# Altium schematic sheet Dcdc.12V0.+3V3.SchDoc
size A4
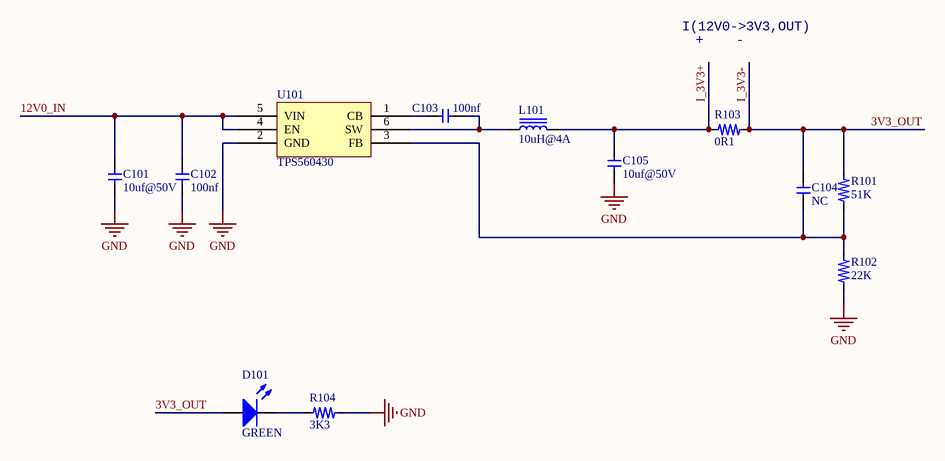
[diagram p0: Dcdc.12V0.+3V3.SchDoc]

## Parts
C101  value 10uf@50V  [C1210]  (hidden comment: Cap)
C102  value 100nf  [C0603]  (hidden comment: Cap)
C103  value 100nf  [C0603]  (hidden comment: Cap)
C104  value NC  [C0603]  (hidden comment: Cap)
C105  value 10uf@50V  [C1210]  (hidden comment: Cap)
D101  value GREEN  [LED0603]  (hidden comment: LED)
L101  value 10uH@4A  [L06063]  (hidden comment: Inductor Iron)
R101  value 51K  [R0603]  (hidden comment: Res)
R102  value 22K  [R0603]  (hidden comment: Res)
R103  value 0R1  [R1206]  (hidden comment: Res)
R104  value 3K3  [R0603]  (hidden comment: Res)
U101  TPS560430  [TPS560430-SOT23-6]

## Nets
GND: C101.1 C102.1 C105.1 R102.1 R104.1 U101.2(GND)
3V3_OUT: C104.1 D101.1(A) R101.2 R103.2  [also labelled I_3V3-]
12V0_IN: C101.2 C102.2 U101.4(EN) U101.5(VIN)
I_3V3+: C105.2 L101.2 R103.1
NetC103_1: C103.1 L101.1 U101.6(SW)
NetC103_2: C103.2 U101.1(CB)
NetC104_2: C104.2 R101.1 R102.2 U101.3(FB)
NetD101_2: D101.2(K) R104.2

## Notes on the sheet
- I(12V0->3V3,OUT)
- +
- -

## Library data of the parts
L101 = Inductor Iron: Magnetic-Core Inductor
R101-R104 = Res: 电阻
U101 = TPS560430: TPS560430 SIMPLE SWITCHER® 4-V to 36-V, 600-mA Synchronous Step-Down Converter